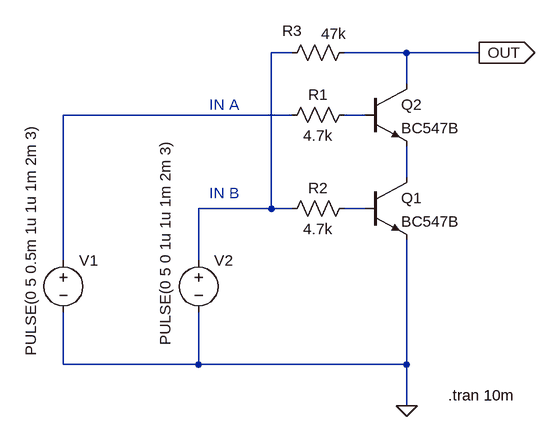
[diagram p0: schematic trans_xor.asc]
trans_xor.asc, the LTspice schematic file:
Version 4
SHEET 1 1872 1076
WIRE -48 -208 -80 -208
WIRE 128 -208 32 -208
WIRE 240 -208 128 -208
WIRE 128 -160 128 -208
WIRE -48 -112 -400 -112
WIRE 64 -112 32 -112
WIRE 128 -16 128 -64
WIRE -80 32 -80 -208
WIRE -80 32 -192 32
WIRE -48 32 -80 32
WIRE 64 32 32 32
WIRE -400 112 -400 -112
WIRE -192 112 -192 32
WIRE -400 272 -400 192
WIRE -192 272 -192 192
WIRE -192 272 -400 272
WIRE 128 272 128 80
WIRE 128 272 -192 272
WIRE 128 336 128 272
FLAG 240 -208 OUT
IOPIN 240 -208 Out
FLAG 128 336 0
SYMBOL npn 64 -16 R0
SYMATTR InstName Q1
SYMATTR Value BC547B
SYMBOL npn 64 -160 R0
SYMATTR InstName Q2
SYMATTR Value BC547B
SYMBOL voltage -192 96 R0
WINDOW 123 0 0 Left 0
WINDOW 39 0 0 Left 0
WINDOW 3 -51 -170 VRight 2
SYMATTR Value PULSE(0 5 0 1u 1u 1m 2m 3)
SYMATTR InstName V2
SYMBOL res 48 16 R90
WINDOW 0 0 56 VBottom 2
WINDOW 3 32 56 VTop 2
SYMATTR InstName R2
SYMATTR Value 4.7k
SYMBOL res 48 -128 R90
WINDOW 0 0 56 VBottom 2
WINDOW 3 32 56 VTop 2
SYMATTR InstName R1
SYMATTR Value 4.7k
SYMBOL voltage -400 96 R0
WINDOW 123 0 0 Left 0
WINDOW 39 0 0 Left 0
WINDOW 3 -50 -195 VRight 2
SYMATTR Value PULSE(0 5 0.5m 1u 1u 1m 2m 3)
SYMATTR InstName V1
SYMBOL res 48 -224 R90
WINDOW 0 -2 96 VBottom 2
WINDOW 3 -29 32 VTop 2
SYMATTR InstName R3
SYMATTR Value 47k
TEXT 192 320 Left 2 !.tran 10m
TEXT -176 -128 Left 2 ;IN A
TEXT -176 8 Left 2 ;IN B

The netlist it stands for:
* trans_xor.asc
Q1 N004 N005 0 0 BC547B
Q2 OUT N003 N004 0 BC547B
V2 N001 0 PULSE(0 5 0 1u 1u 1m 2m 3)
R2 N005 N001 4.7k
R1 N003 N002 4.7k
V1 N002 0 PULSE(0 5 0.5m 1u 1u 1m 2m 3)
R3 OUT N001 47k
.model NPN NPN
.model PNP PNP
.lib standard.bjt
.tran 10m
* IN A
* IN B
.backanno
.end